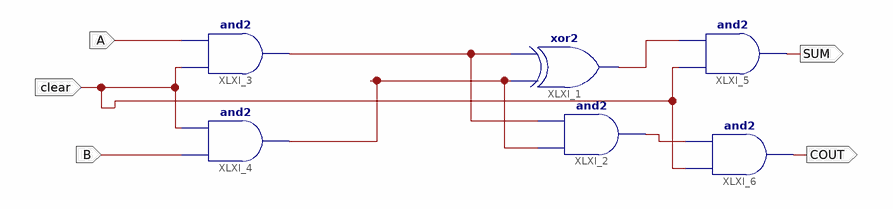
[diagram p0: schematic sheet 1]
// Xilinx ISE schematic half_adder_clear.sch (artix7) as structural Verilog: 6 symbols, 5 ports
module half_adder_clear (
  input  A,
  input  B,
  input  clear,
  output SUM,
  output COUT
);

  wire XLXN_5, XLXN_6, XLXN_11, XLXN_15;

  xor XLXI_1 (XLXN_11, XLXN_6, XLXN_5);
  and XLXI_2 (XLXN_15, XLXN_6, XLXN_5);
  and XLXI_3 (XLXN_5, clear, A);
  and XLXI_4 (XLXN_6, B, clear);
  and XLXI_5 (SUM, clear, XLXN_11);
  and XLXI_6 (COUT, clear, XLXN_15);
endmodule
